# Altium schematic sheet STORAGE.SchDoc
size 420 x 297 mm; SheetNumber: 5; SheetTotal: 8
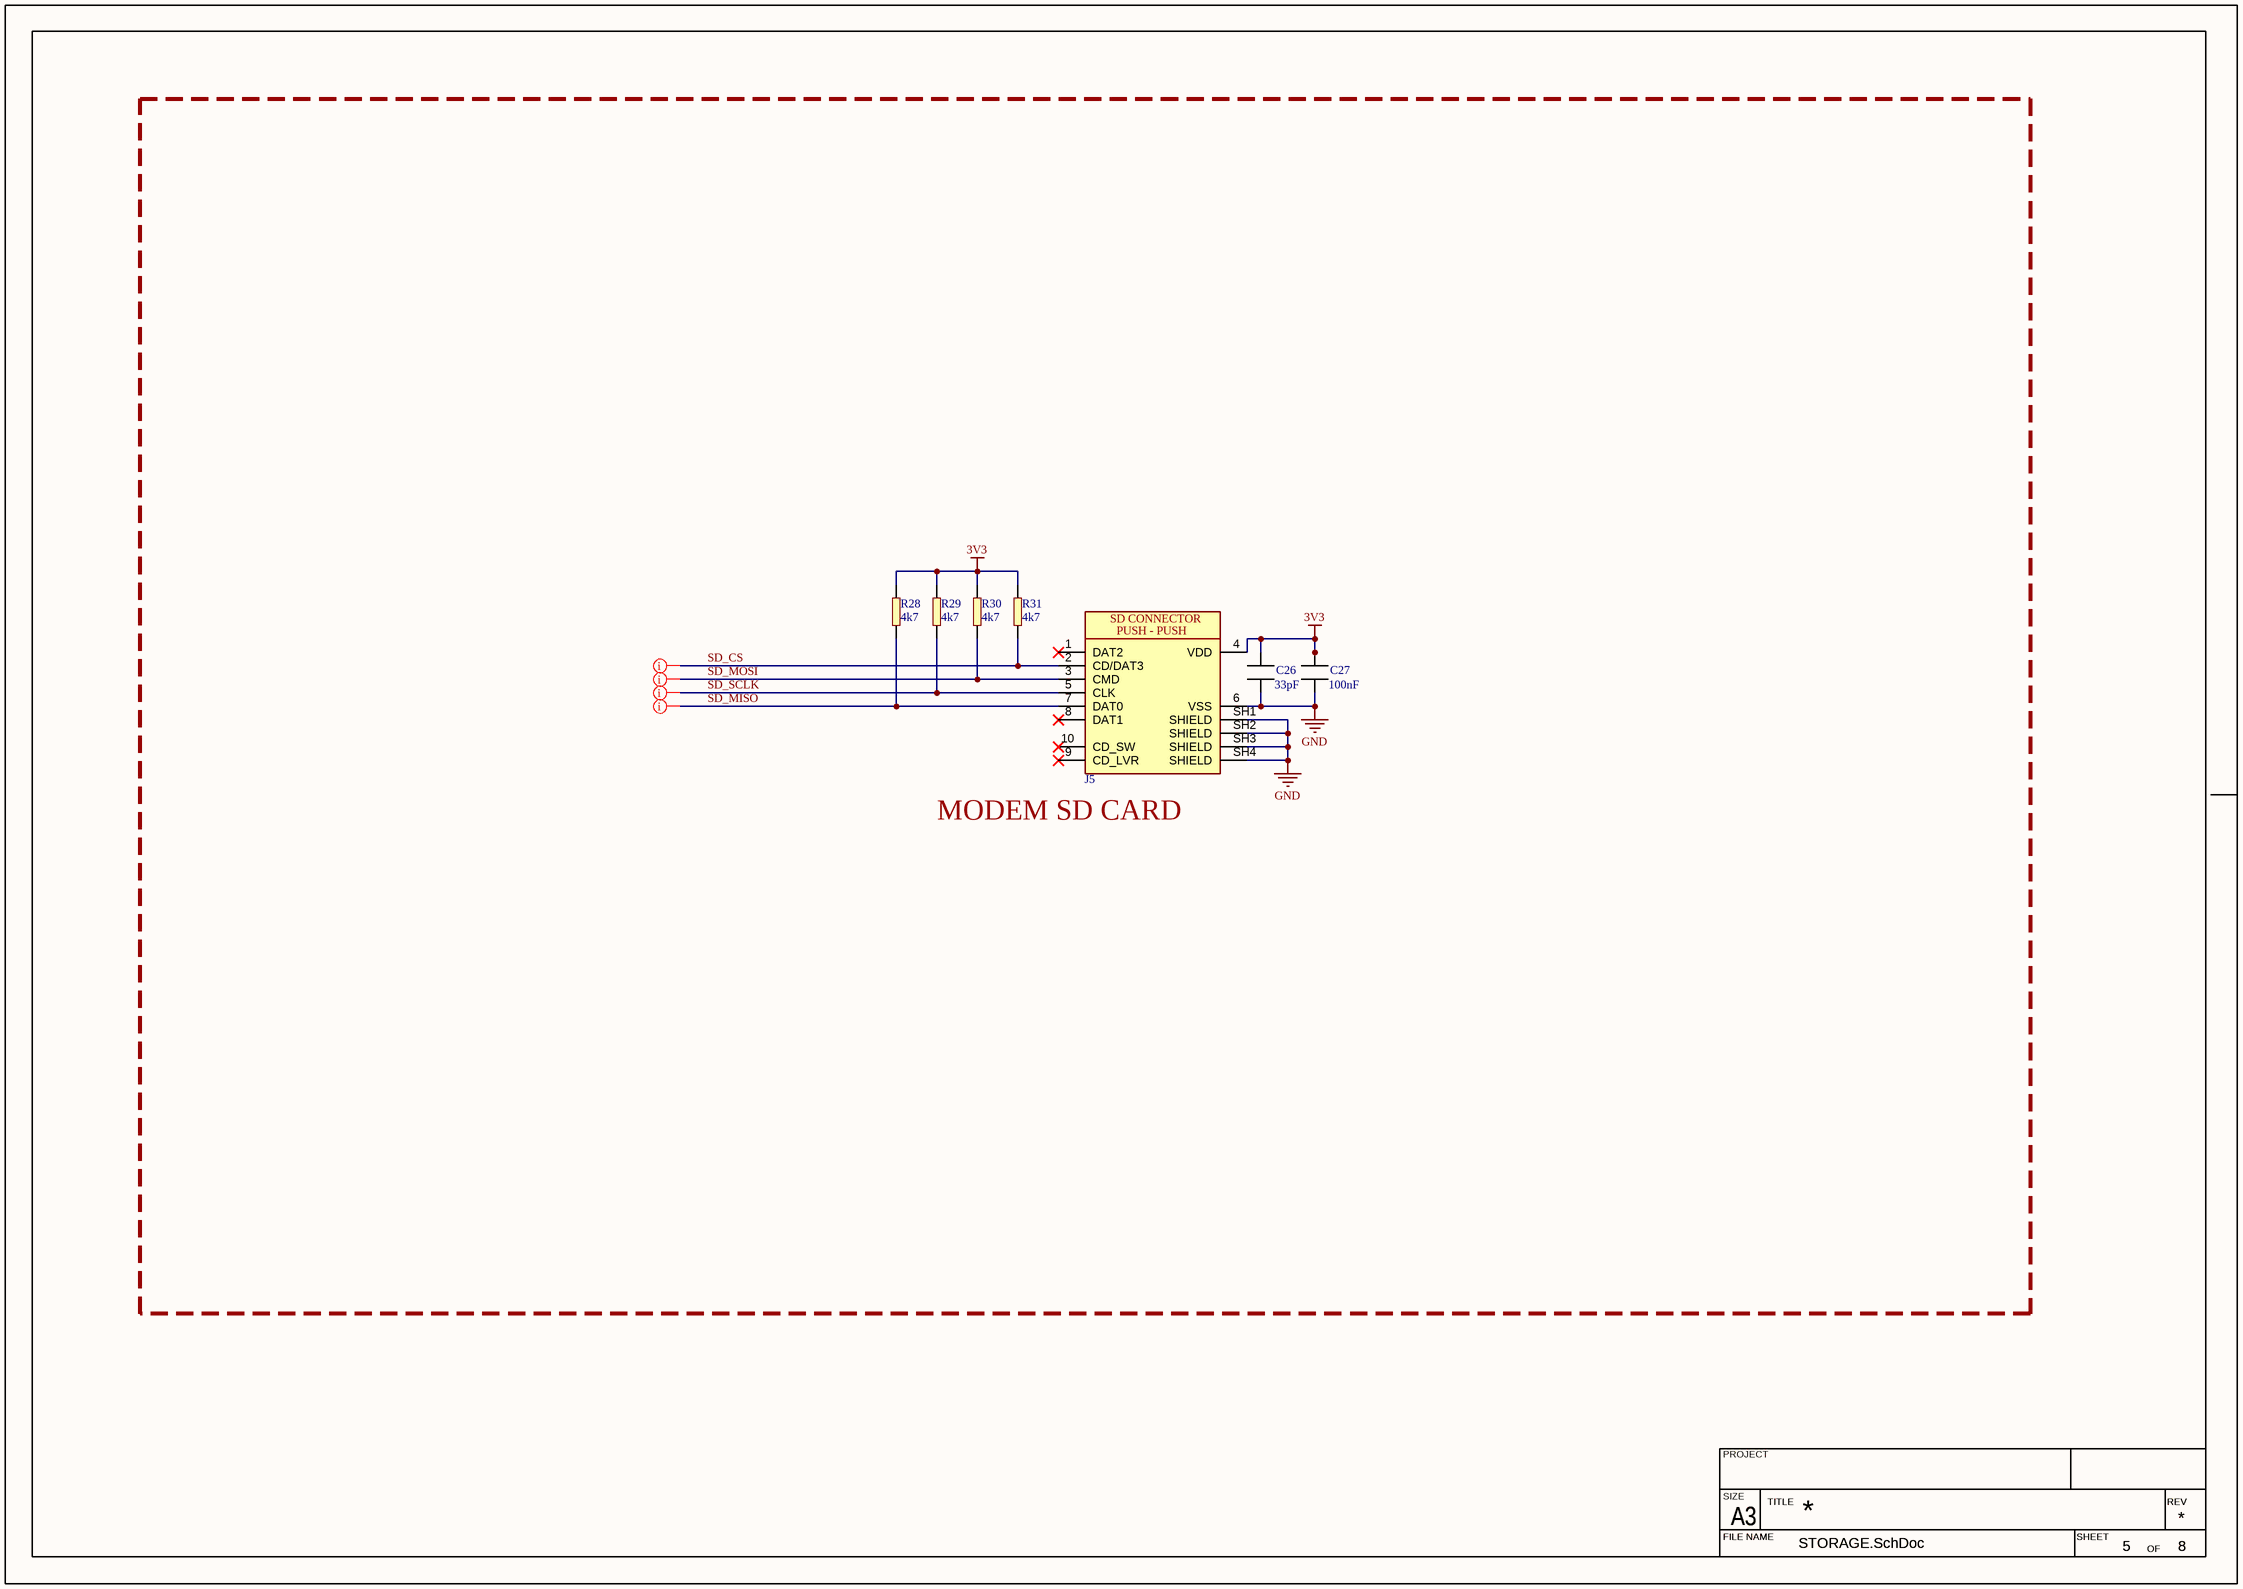
[diagram p0: STORAGE.SchDoc]

## Parts
C26  value 33pF  [CAPC2012X13L]  (hidden comment: MLCC_0805)
C27  value 100nF  [CAPC2012X13L]  (hidden comment: MLCC_0805)
J5  5033981892  [5033981892]  (value not drawn)
R28  value 4k7  [RES_0603]  (hidden comment: ERP_101-1)
R29  value 4k7  [RES_0603]  (hidden comment: ERP_101-1)
R30  value 4k7  [RES_0603]  (hidden comment: ERP_101-1)
R31  value 4k7  [RES_0603]  (hidden comment: ERP_101-1)

## Blocks framed on the sheet
MODEM SD CARD: C26 C27 J5 R28-R31

## Nets
3V3: C26.1 C27.1 J5.4(VDD) R28.2 R29.2 R30.2 R31.2
GND: C26.2 C27.2 J5.6(VSS) J5.SH1(SHIELD) J5.SH2(SHIELD) J5.SH3(SHIELD) J5.SH4(SHIELD)
SD_CS: J5.2(CD/DAT3) R31.1
SD_MISO: J5.7(DAT0) R28.1
SD_MOSI: J5.3(CMD) R30.1
SD_SCLK: J5.5(CLK) R29.1

Not connected (* = marked no-connect by the designer): J5 1(DAT2)* 8(DAT1)* 9(CD_LVR)* 10(CD_SW)*

## Layout directives
rule Width Constraint [Pref Impedance = 50.00ohms    Min Impedance = 50.00ohms    Max Impedance = 50.00ohms]: SD_CS, SD_MISO, SD_MOSI, SD_SCLK

## Notes on the sheet
- PROJECT
- SIZE
- FILE NAME
- A3
- TITLE
- SHEET
- OF
- REV
- (in symbol 5033981892) SD CONNECTOR; PUSH - PUSH

## Library data of the parts
C26 C27 = MLCC_0805: Chip Capacitor, 2-Leads, Body 2.00x1.25mm, IPC High Density; Package: 0805; Manufacturer 1: *; Manufacturer Part Number 1: *
J5 = 5033981892: 9 (8 + 1) Position Card Connector Secure Digital - microSD™ Surface Mount, Right Angle Gold; Manufacturer 1: Molex; Manufacturer Part Number 1: 5033981892; Package: 9 (8+1); Value: *
R28-R31 = RES_0603: Package: 0603; Manufacturer 1: *; Manufacturer Part Number 1: *